# Altium project STM8Clock.PrjPcb
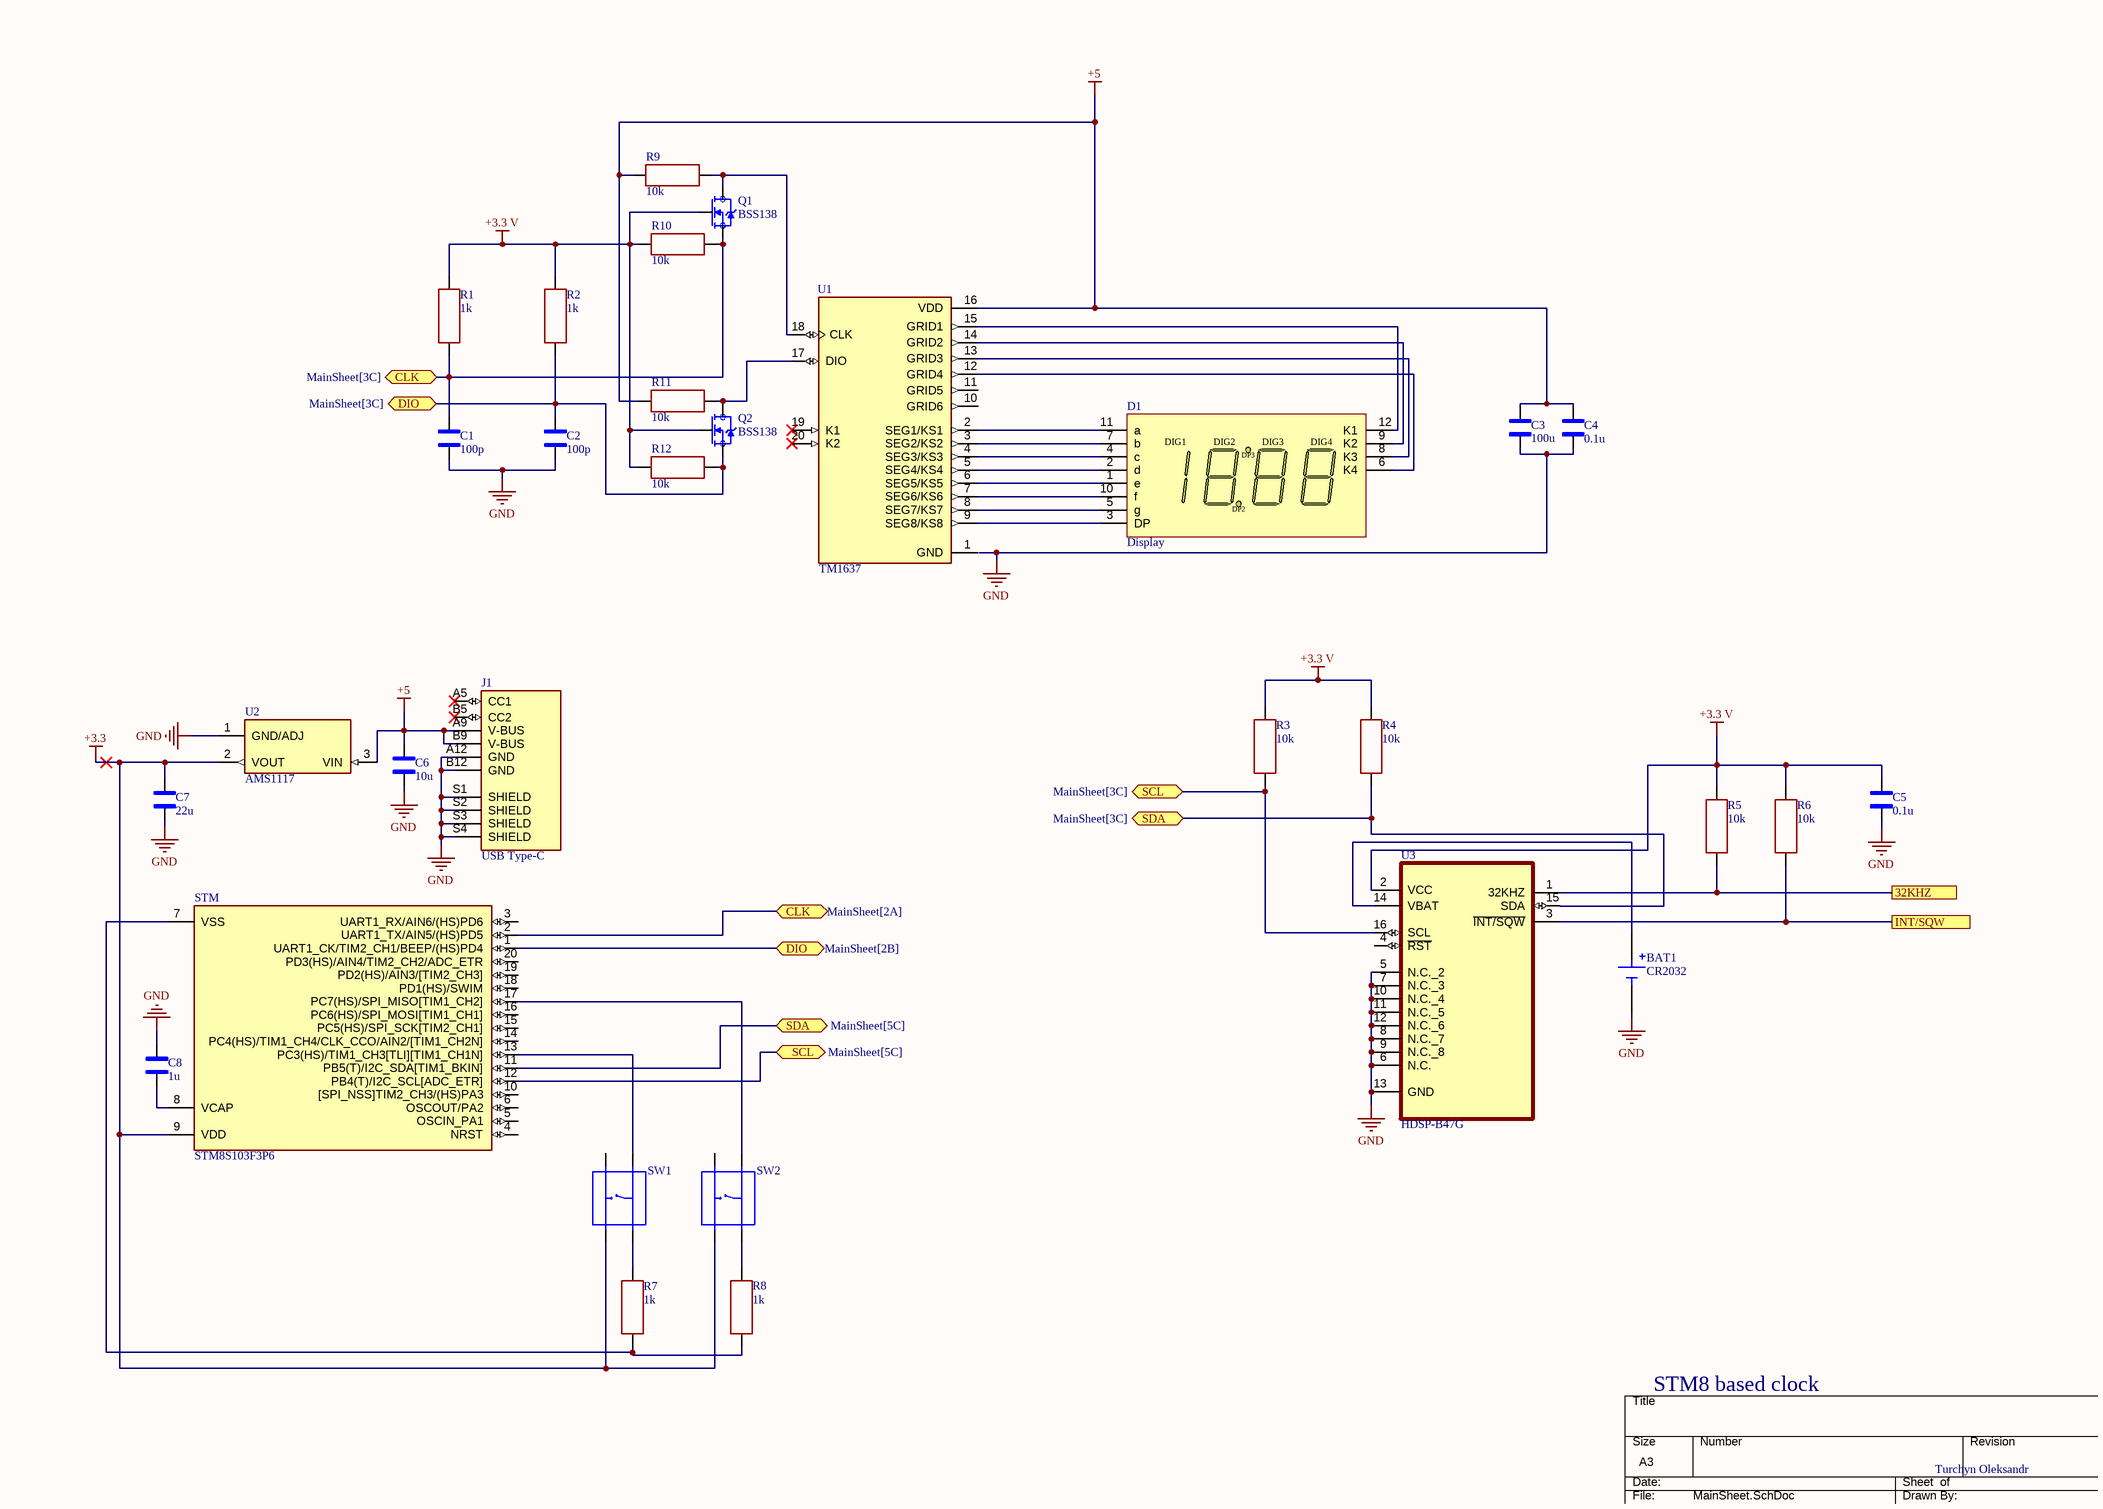
[diagram p0: MainSheet.SchDoc]
1 sheet, 31 parts. Net scope: flat (ports and power ports of the same name join across sheets).
Board file: PCB1.PcbDoc

## Sheet MainSheet.SchDoc
size A3; Author: Turchyn Oleksandr; SheetNumber: 1; SheetTotal: 1; SPICEModelCacheVHUKMFLD: <root> / <DocumentId>VHUKMFLD</DocumentId> / </root>

### Parts
BAT1  CR2032  [BAT_1072]
C1  100p  [CAPRR2250W100L2700T1050H1900]
C2  100p  [CAPRR2250W100L2700T1050H1900]
C3  100u  [CAPRR2250W100L2700T1050H1900]
C4  0.1u  [CAPRR2250W100L2700T1050H1900]
C5  0.1u  [CAPRR2250W100L2700T1050H1900]
C6  10u  [CAPRR2250W100L2700T1050H1900]
C7  22u  [CAPRR2250W100L2700T1050H1900]
C8  1u  [CAPRR2250W100L2700T1050H1900]
D1  Display  [HDSP-B4]
J1  USB Type-C  [CUI_UJC-HP-3-SMT-TR]
Q1  BSS138  [SOT95P240X111-3N]
Q2  BSS138  [SOT95P240X111-3N]
R1  1k  [Resistor]
R2  1k  [Resistor]
R3  10k  [Resistor]
R4  10k  [Resistor]
R5  10k  [Resistor]
R6  10k  [Resistor]
R7  1k  [Resistor]
R8  1k  [Resistor]
R9  10k  [Resistor]
R10  10k  [Resistor]
R11  10k  [Resistor]
R12  10k  [Resistor]
STM  STM8S103F3P6  [SOP65P640X120-20N]
SW1  SMD-BUTTON(4P-5.2X5.2X1.5MM-SKQGAKE010)  [SW4-SMD-5.2X5.2X1.5MM]  (value not drawn)
SW2  SMD-BUTTON(4P-5.2X5.2X1.5MM-SKQGAKE010)  [SW4-SMD-5.2X5.2X1.5MM]  (value not drawn)
U1  TM1637  [DIP778W43P254L2612H431Q20N]
U2  AMS1117  [SOT229P700X180-4N]
U3  HDSP-B47G  [HDSP-B4]

### Ports
32KHZ, CLK (bidir, see MainSheet[2A]), CLK (bidir, see MainSheet[3C]), DIO (bidir, see MainSheet[2B]), DIO (bidir, see MainSheet[3C]), INT/SQW, SCL (bidir, see MainSheet[3C]), SCL (bidir, see MainSheet[5C]), SDA (bidir, see MainSheet[3C]), SDA (bidir, see MainSheet[5C])

### Nets
+3.3: C7.1 STM.9(VDD) SW1.4(B1) SW2.4(B1) U2.2(VOUT)
+3.3 V: C5.1 Q1.1(G) Q2.1(G) R1.2 R2.2 R3.2 R4.2 R5.2 R6.2 R10.1 R12.1 U3.2(VCC)
+5: C3.1 C4.1 C6.1 J1.A9(V-BUS) J1.B9(V-BUS) R9.1 R11.1 U1.16(VDD) U2.3(VIN)
GND: BAT1.N(NEG) C1.2 C2.2 C3.2 C4.2 C5.2 C6.2 C7.2 C8.2 J1.A12(GND) J1.B12(GND) J1.S1(SHIELD) J1.S2(SHIELD) J1.S3(SHIELD) J1.S4(SHIELD) U2.1(GND/ADJ) U3.5(N.C._2) U3.6(N.C.) U3.7(N.C._3) U3.8(N.C._7) U3.9(N.C._8) U3.10(N.C._4) U3.11(N.C._5) U3.12(N.C._6) U3.13(GND)
NetBAT1_P: BAT1.P(POS) U3.14(VBAT)
NetC1_1: C1.1 Q1.2(S) R1.1 R10.2 STM.2(UART1_TX/AIN5/(HS)PD5) ; port CLK
NetC2_1: C2.1 Q2.2(S) R2.1 R12.2 STM.1(UART1_CK/TIM2_CH1/BEEP/(HS)PD4) ; port DIO
NetC8_1: C8.1 STM.8(VCAP)
NetD1_1: D1.1(e) U1.6(SEG5/KS5)
NetD1_2: D1.2(d) U1.5(SEG4/KS4)
NetD1_3: D1.3(DP) U1.9(SEG8/KS8)
NetD1_4: D1.4(c) U1.4(SEG3/KS3)
NetD1_5: D1.5(g) U1.8(SEG7/KS7)
NetD1_6: D1.6(K4) U1.12(GRID4)
NetD1_7: D1.7(b) U1.3(SEG2/KS2)
NetD1_8: D1.8(K3) U1.13(GRID3)
NetD1_9: D1.9(K2) U1.14(GRID2)
NetD1_10: D1.10(f) U1.7(SEG6/KS6)
NetD1_11: D1.11(a) U1.2(SEG1/KS1)
NetD1_12: D1.12(K1) U1.15(GRID1)
NetQ1_3: Q1.3(D) R9.2 U1.18(CLK)
NetQ2_3: Q2.3(D) R11.2 U1.17(DIO)
NetR3_1: R3.1 STM.12(PB4(T)/I2C_SCL[ADC_ETR]) U3.16(SCL) ; port SCL
NetR4_1: R4.1 STM.11(PB5(T)/I2C_SDA[TIM1_BKIN]) U3.15(SDA) ; port SDA
NetR5_1: R5.1 U3.1(32KHZ) ; port 32KHZ
NetR6_1: R6.1 U3.3(~{INT/SQW}) ; port INT/SQW
NetR7_1: R7.1 R8.1 STM.7(VSS)
NetR7_2: R7.2 SW1.2(A1)
NetR8_2: R8.2 SW2.2(A1)
NetSTM_13: STM.13(PC3(HS)/TIM1_CH3[TLI][TIM1_CH1N]) SW1.1(A0)
NetSTM_17: STM.17(PC7(HS)/SPI_MISO[TIM1_CH2]) SW2.1(A0)

Not connected (* = marked no-connect by the designer): J1 A5(CC1)* B5(CC2)*; STM 3(UART1_RX/AIN6/(HS)PD6) 4(NRST) 5(OSCIN_PA1) 6(OSCOUT/PA2) 10([SPI_NSS]TIM2_CH3/(HS)PA3) 14(PC4(HS)/TIM1_CH4/CLK_CCO/AIN2/[TIM1_CH2N]) 15(PC5(HS)/SPI_SCK[TIM2_CH1]) 16(PC6(HS)/SPI_MOSI[TIM1_CH1]) 18(PD1(HS)/SWIM) 19(PD2(HS)/AIN3/[TIM2_CH3]) 20(PD3(HS)/AIN4/TIM2_CH2/ADC_ETR); SW1 3(B0); SW2 3(B0); U1 1(GND) 10(GRID6) 11(GRID5) 19(K1)* 20(K2)*; U3 4(~{RST})

### Notes on the sheet
- STM8 based clock
- Turchyn Oleksandr
- THIS DOCUMENT AND THE DATA DISCLOSED HEREIN OR
- HEREWITH IS THE PROPERTY OF ALTIUM LIMITED AND MAY
- DWG NO:
- REVISION
- REV:
- DESCRIPTION
- DATE
- APPROVED
- BE FREELY DISTRIBUTED IN WHOLE. NO RIGHTS ARE
- RESERVED OR EXPRESS OR IMPLIED WARANTEE GIVEN.
- ENG:
- APPROVALS
- PROJECT
- DSN:
- CHK:
- REFERENCE DOCUMENTS
- PROJECT REVISION:
- TITLE
- DOCUMENT REVISION:
- DESIGN ITEM:
- BOM:
- FAB DWG:
- PCB DWG:
- ASSY DWG:
- SCALE:
- A3
- SIZE
- CAGE CODE
- FILE NAME
- DWG NO.
- SHEET
- OF
- REV
- (in symbol Display7Segmwnt4Digit) DIG1; DIG2; DIG3; DIG4; DP3; DP2

### Library data of the parts
BAT1 = Battery1072
C1-C8 = Capacitor
D1 = Display7Segmwnt4Digit
J1 = USBTypeC
R1-R12 = Resistor
STM = STM8S103F3
SW1 SW2 = SWButton
U3 = DS3231S